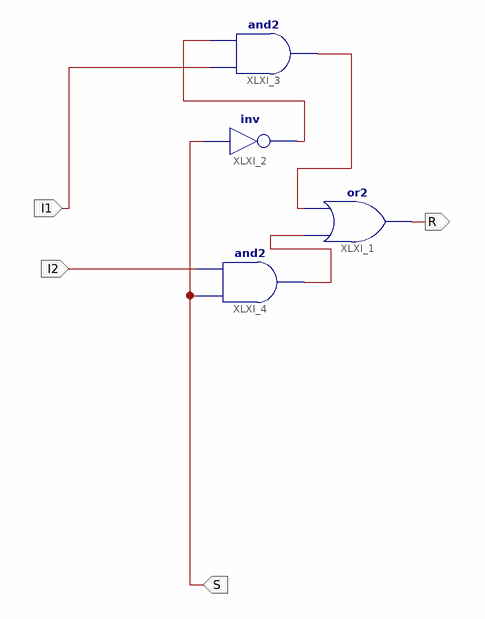
[diagram p0: schematic sheet 1]
// Xilinx ISE schematic MUX_2x1.sch (spartan3) as structural Verilog: 4 symbols, 4 ports
module MUX_2x1 (
  input  I1,
  input  I2,
  input  S,
  output R
);

  wire XLXN_9, XLXN_10, XLXN_11;

  or XLXI_1 (R, XLXN_10, XLXN_9);
  not XLXI_2 (XLXN_11, S);
  and XLXI_3 (XLXN_9, I1, XLXN_11);
  and XLXI_4 (XLXN_10, S, I2);
endmodule
